# Altium schematic sheet ATmega4809_Curiosity_Nano_Revision_History.SchDoc
size A3; SheetTitle: Revision History; CompanyName: Microchip Technology Inc.; Organization: Microchip Technology; Address1: 2355 West Chandler Blvd.; Address2: Chandler, AZ  85224; Address4: USA; SheetNumber: 4; SheetTotal: 4; Time: Time
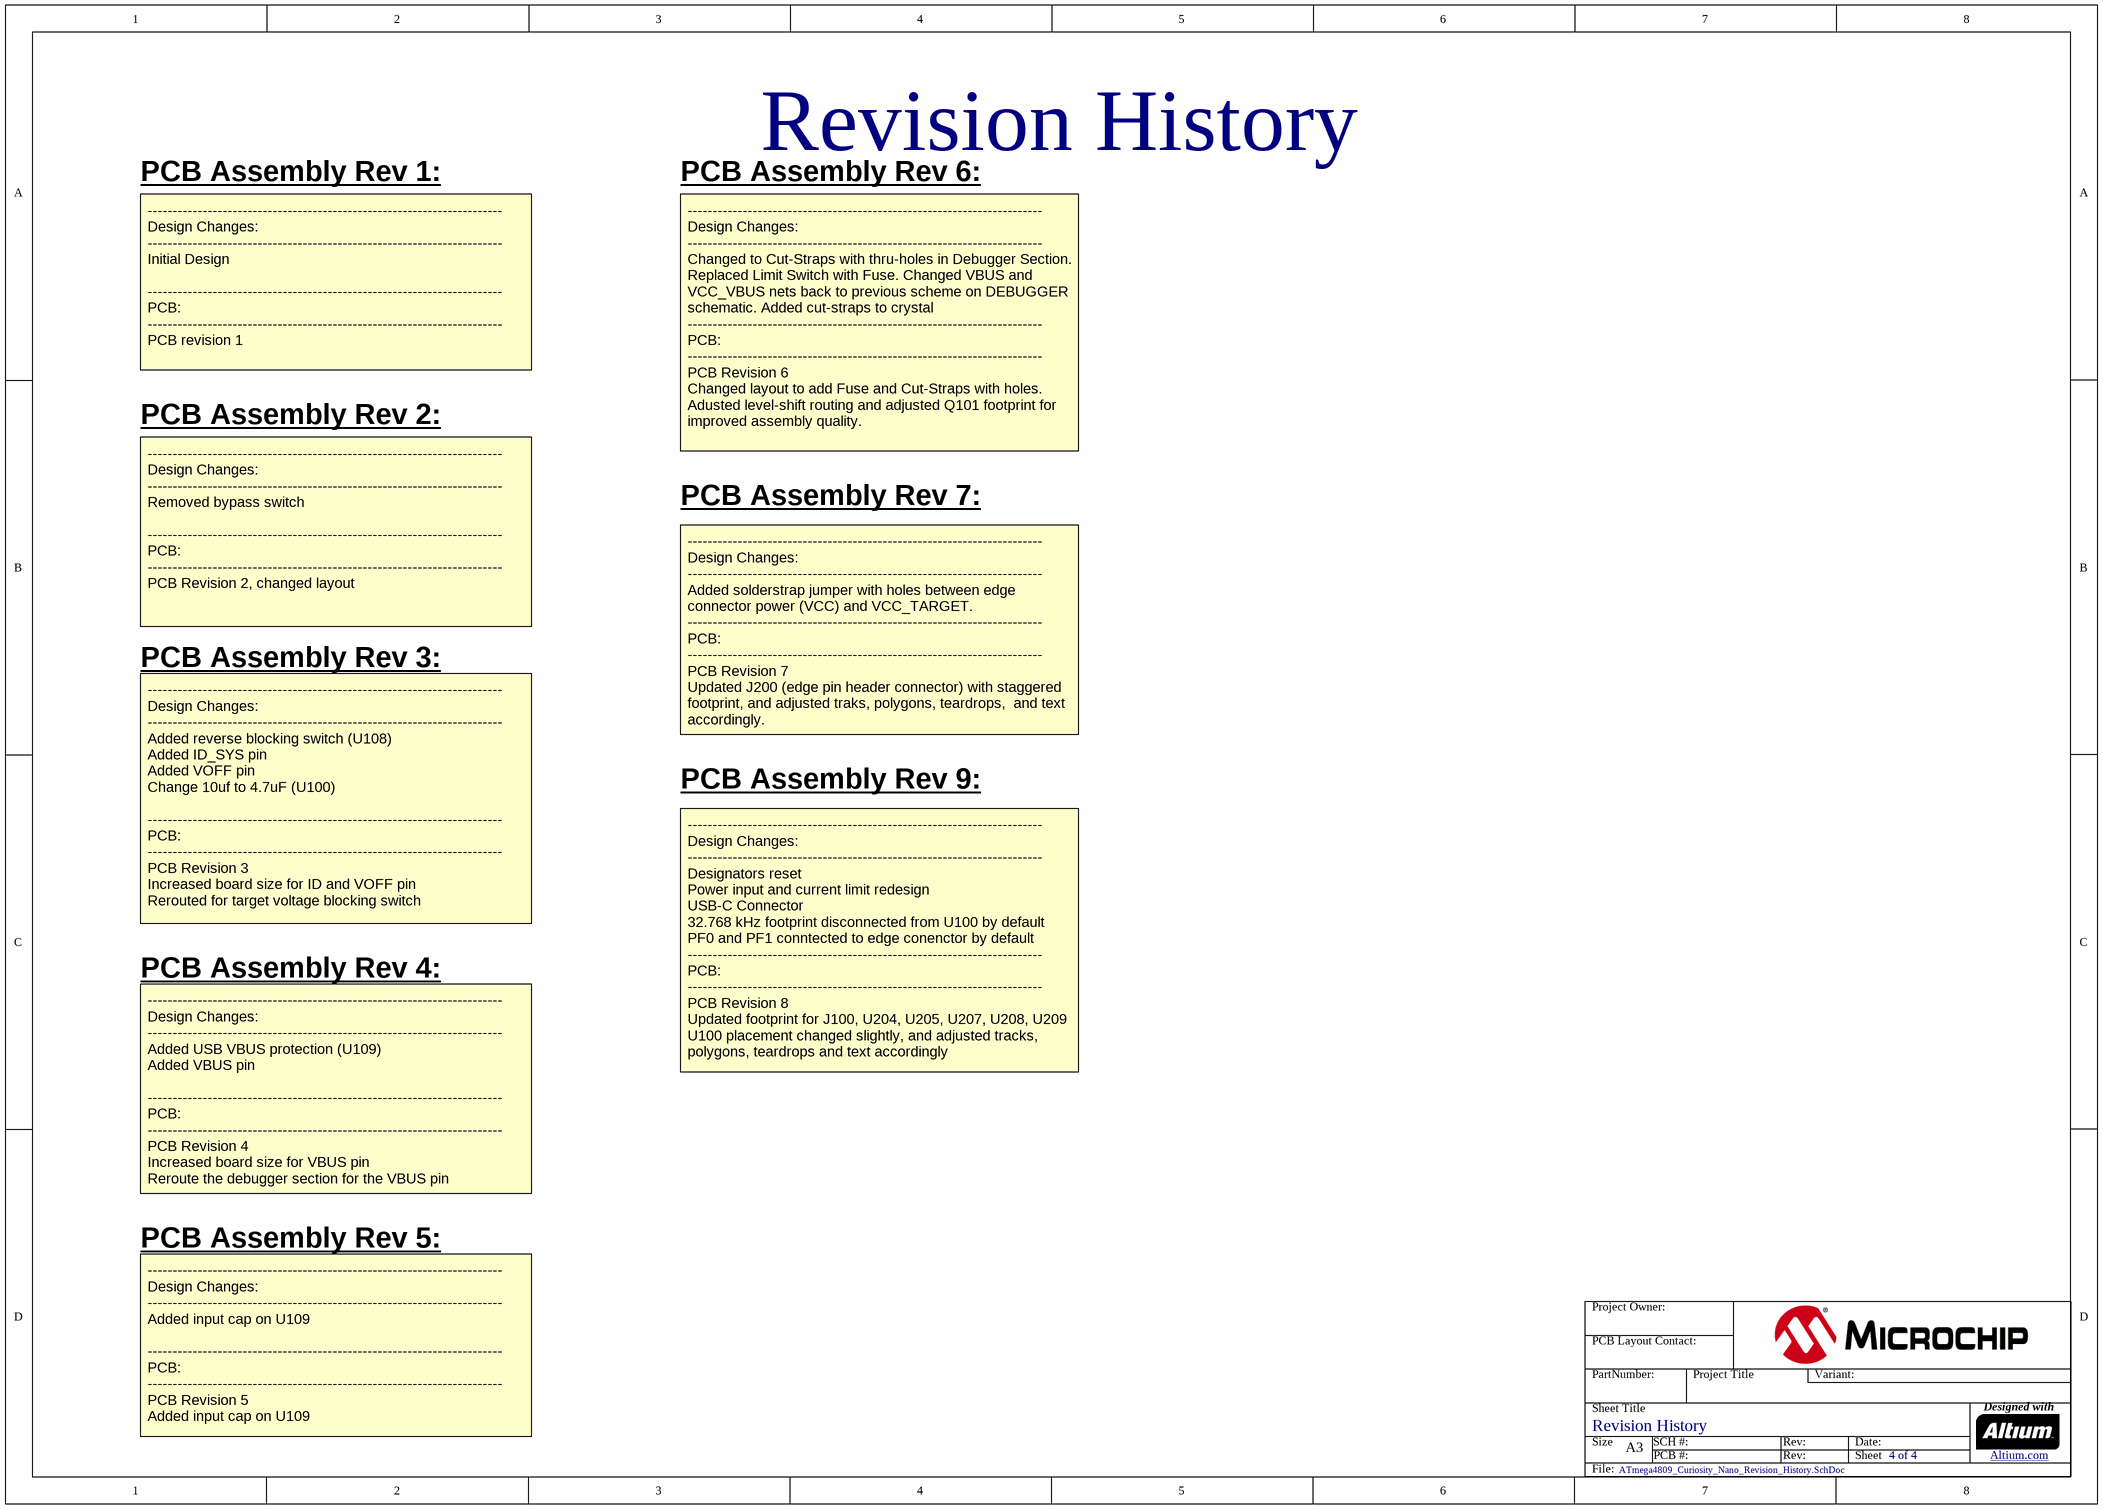
[diagram p0: ATmega4809_Curiosity_Nano_Revision_History.SchDoc]

## Notes on the sheet
- Revision History
- PCB Assembly Rev 1:
- PCB Assembly Rev 6:
- -----------------------------------------------------------------------
  Design Changes:
  -----------------------------------------------------------------------
  Initial Design
  -----------------------------------------------------------------------
  PCB:
  -----------------------------------------------------------------------
  PCB revision 1
- PCB Assembly Rev 2:
- -----------------------------------------------------------------------
  Design Changes:
  -----------------------------------------------------------------------
  Changed to Cut-Straps with thru-holes in Debugger Section.
  Replaced Limit Switch with Fuse. Changed VBUS and VCC_VBUS nets back to previous scheme on DEBUGGER schematic. Added cut-straps to crystal
  -----------------------------------------------------------------------
  PCB:
  -----------------------------------------------------------------------
  PCB Revision 6
  Changed layout to add Fuse and Cut-Straps with holes. Adusted level-shift routing and adjusted Q101 footprint for improved assembly quality.
- PCB Assembly Rev 7:
- -----------------------------------------------------------------------
  Design Changes:
  -----------------------------------------------------------------------
  Removed bypass switch
  -----------------------------------------------------------------------
  PCB:
  -----------------------------------------------------------------------
  PCB Revision 2, changed layout
- PCB Assembly Rev 3:
- -----------------------------------------------------------------------
  Design Changes:
  -----------------------------------------------------------------------
  Added solderstrap jumper with holes between edge connector power (VCC) and VCC_TARGET.
  -----------------------------------------------------------------------
  PCB:
  -----------------------------------------------------------------------
  PCB Revision 7
  Updated J200 (edge pin header connector) with staggered footprint, and adjusted traks, polygons, teardrops,  and text accordingly.
- PCB Assembly Rev 9:
- -----------------------------------------------------------------------
  Design Changes:
  -----------------------------------------------------------------------
  Added reverse blocking switch (U108)
  Added ID_SYS pin
  Added VOFF pin
  Change 10uf to 4.7uF (U100)
  -----------------------------------------------------------------------
  PCB:
  -----------------------------------------------------------------------
  PCB Revision 3
  Increased board size for ID and VOFF pin
  Rerouted for target voltage blocking switch
- PCB Assembly Rev 4:
- -----------------------------------------------------------------------
  Design Changes:
  -----------------------------------------------------------------------
  Designators reset
  Power input and current limit redesign
  USB-C Connector
  32.768 kHz footprint disconnected from U100 by default
  PF0 and PF1 conntected to edge conenctor by default
  -----------------------------------------------------------------------
  PCB:
  -----------------------------------------------------------------------
  PCB Revision 8
  Updated footprint for J100, U204, U205, U207, U208, U209
  U100 placement changed slightly, and adjusted tracks, polygons, teardrops and text accordingly
- -----------------------------------------------------------------------
  Design Changes:
  -----------------------------------------------------------------------
  Added USB VBUS protection (U109)
  Added VBUS pin
  -----------------------------------------------------------------------
  PCB:
  -----------------------------------------------------------------------
  PCB Revision 4
  Increased board size for VBUS pin
  Reroute the debugger section for the VBUS pin
- PCB Assembly Rev 5:
- -----------------------------------------------------------------------
  Design Changes:
  -----------------------------------------------------------------------
  Added input cap on U109
  -----------------------------------------------------------------------
  PCB:
  -----------------------------------------------------------------------
  PCB Revision 5
  Added input cap on U109
- Project Owner:
- PCB Layout Contact:
- PartNumber:
- Project Title
- Variant:
- Sheet Title
- Size
- A3
- SCH #:
- PCB #:
- Rev:
- Date:
- Sheet
- Designed with
- Altium.com <http://go.altium.com/MicrochipLandingPage_Evaluation.html>
- File: